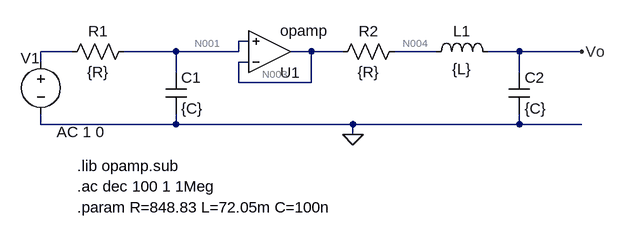
[diagram p0: schematic TPS3_4.asc]
TPS3_4.asc, the LTspice schematic file:
Version 4
SHEET 1 880 680
WIRE 256 64 240 64
WIRE -16 80 -64 80
WIRE 144 80 64 80
WIRE 240 80 240 64
WIRE 240 80 144 80
WIRE 352 80 320 80
WIRE 400 80 352 80
WIRE 544 80 480 80
WIRE 672 80 624 80
WIRE 768 80 672 80
WIRE -64 96 -64 80
WIRE 256 96 240 96
WIRE 144 112 144 80
WIRE 672 112 672 80
WIRE 240 128 240 96
WIRE 352 128 352 80
WIRE 352 128 240 128
WIRE -64 192 -64 176
WIRE 144 192 144 176
WIRE 144 192 -64 192
WIRE 416 192 144 192
WIRE 672 192 672 176
WIRE 672 192 416 192
WIRE 768 192 672 192
WIRE 416 208 416 192
FLAG 416 208 0
FLAG 768 80 Vo
SYMBOL res 80 64 R90
WINDOW 0 0 56 VBottom 2
WINDOW 3 32 56 VTop 2
SYMATTR InstName R1
SYMATTR Value {R}
SYMBOL cap 128 112 R0
SYMATTR InstName C1
SYMATTR Value {C}
SYMBOL res 496 64 R90
WINDOW 0 0 56 VBottom 2
WINDOW 3 32 56 VTop 2
SYMATTR InstName R2
SYMATTR Value {R}
SYMBOL ind 528 96 R270
WINDOW 0 32 56 VTop 2
WINDOW 3 5 56 VBottom 2
SYMATTR InstName L1
SYMATTR Value {L}
SYMBOL cap 656 112 R0
SYMATTR InstName C2
SYMATTR Value {C}
SYMBOL voltage -64 80 R0
WINDOW 0 -31 10 Left 2
WINDOW 123 24 124 Left 2
WINDOW 39 0 0 Left 0
SYMATTR InstName V1
SYMATTR Value2 AC 1 0
SYMATTR Value ""
SYMBOL OpAmps\\opamp 288 144 M180
SYMATTR InstName U1
TEXT -8 256 Left 2 !.lib opamp.sub
TEXT -8 288 Left 2 !.ac dec 100 1 1Meg
TEXT -8 320 Left 2 !.param R=848.83 L=72.05m C=100n

The netlist it stands for:
* TPS3_4.asc
R1 N001 N002 {R}
C1 N001 0 {C}
R2 N004 N003 {R}
L1 N004 Vo {L}
C2 Vo 0 {C}
V1 N002 0 AC 1 0
XU1 N003 N001 N003 opamp Aol=100K GBW=10Meg  ; pins invin noninvin out
.lib opamp.sub
.ac dec 100 1 1Meg
.param R=848.83 L=72.05m C=100n
.backanno
.end

* Results of the author's LTspice run, read from the files saved beside the schematic
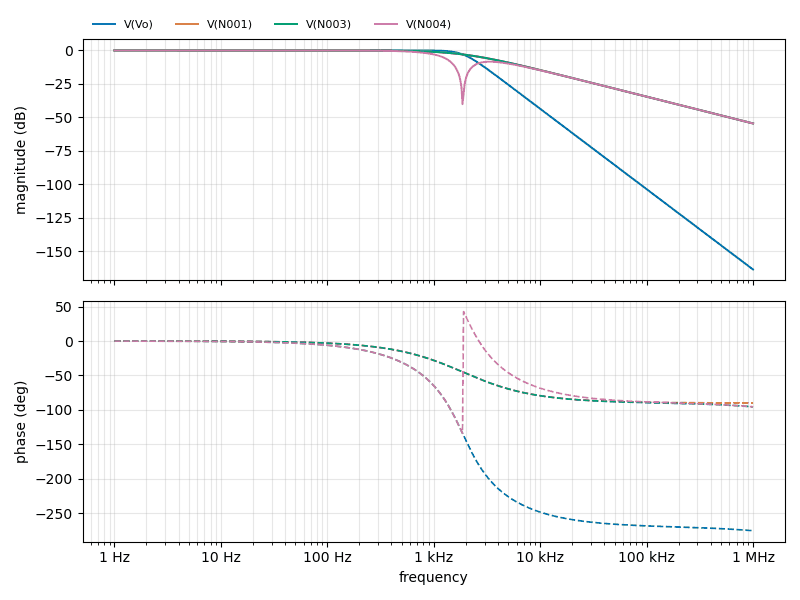
[diagram p1: AC Analysis of TPS3_4.asc, plotted from the saved traces]
* AC Analysis, 1 run:
*   V(Vo): -0.00 dB at 1 Hz, -163.66 dB at 1 MHz, peak -0.00 dB at 1 Hz, 3 dB below the peak at 1.875 kHz
*   V(N001): -0.00 dB at 1 Hz, -54.54 dB at 1 MHz, peak -0.00 dB at 1 Hz, 3 dB below the peak at 1.875 kHz
*   V(N003): -0.00 dB at 1 Hz, -54.58 dB at 1 MHz, peak -0.00 dB at 1 Hz, 3 dB below the peak at 1.875 kHz
*   V(N004): -0.00 dB at 1 Hz, -54.58 dB at 1 MHz, peak -0.00 dB at 1 Hz, 3 dB below the peak at 1.001 kHz